# Altium schematic sheet Glucometer-E.C.- Bluetooth Module.SchDoc
size Letter
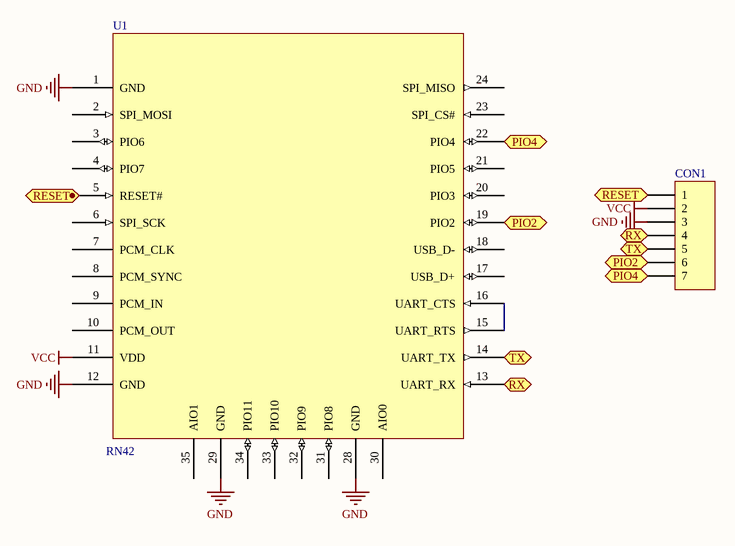
[diagram p0: Glucometer-E.C.- Bluetooth Module.SchDoc]

## Parts
CON1  Header 7  [HDR1X7]  (value not drawn)
U1  value RN42  [RN42-LAND]  (hidden comment: RN42 Module)  (no BOM)

## Ports
PIO2, PIO4, RESET, RX, TX

## Nets
GND: CON1.3 U1.1(GND) U1.12(GND) U1.28(GND) U1.29(GND)
VCC: CON1.2 U1.11(VDD)
PIO2: CON1.6 U1.19(PIO2) ; port PIO2
PIO4: CON1.7 U1.22(PIO4) ; port PIO4
RESET: CON1.1 ; port RESET
RX: CON1.4 U1.13(UART_RX) ; port RX
TX: CON1.5 U1.14(UART_TX) ; port TX
NetU1_15: U1.15(UART_RTS) U1.16(UART_CTS)

Not connected (* = marked no-connect by the designer): U1 2(SPI_MOSI) 3(PIO6) 4(PIO7) 5(RESET#) 6(SPI_SCK) 7(PCM_CLK) 8(PCM_SYNC) 9(PCM_IN) 10(PCM_OUT) 17(USB_D+) 18(USB_D-) 20(PIO3) 21(PIO5) 23(SPI_CS#) 24(SPI_MISO) 30(AIO0) 31(PIO8) 32(PIO9) 33(PIO10) 34(PIO11) 35(AIO1)

## Library data of the parts
CON1 = Header 7: Header, 7-Pin; LatestRevisionDate: 17-Jul-2002; LatestRevisionNote: Re-released for DXP Platform.; Publisher: Altium Limited
U1 = RN42MOD